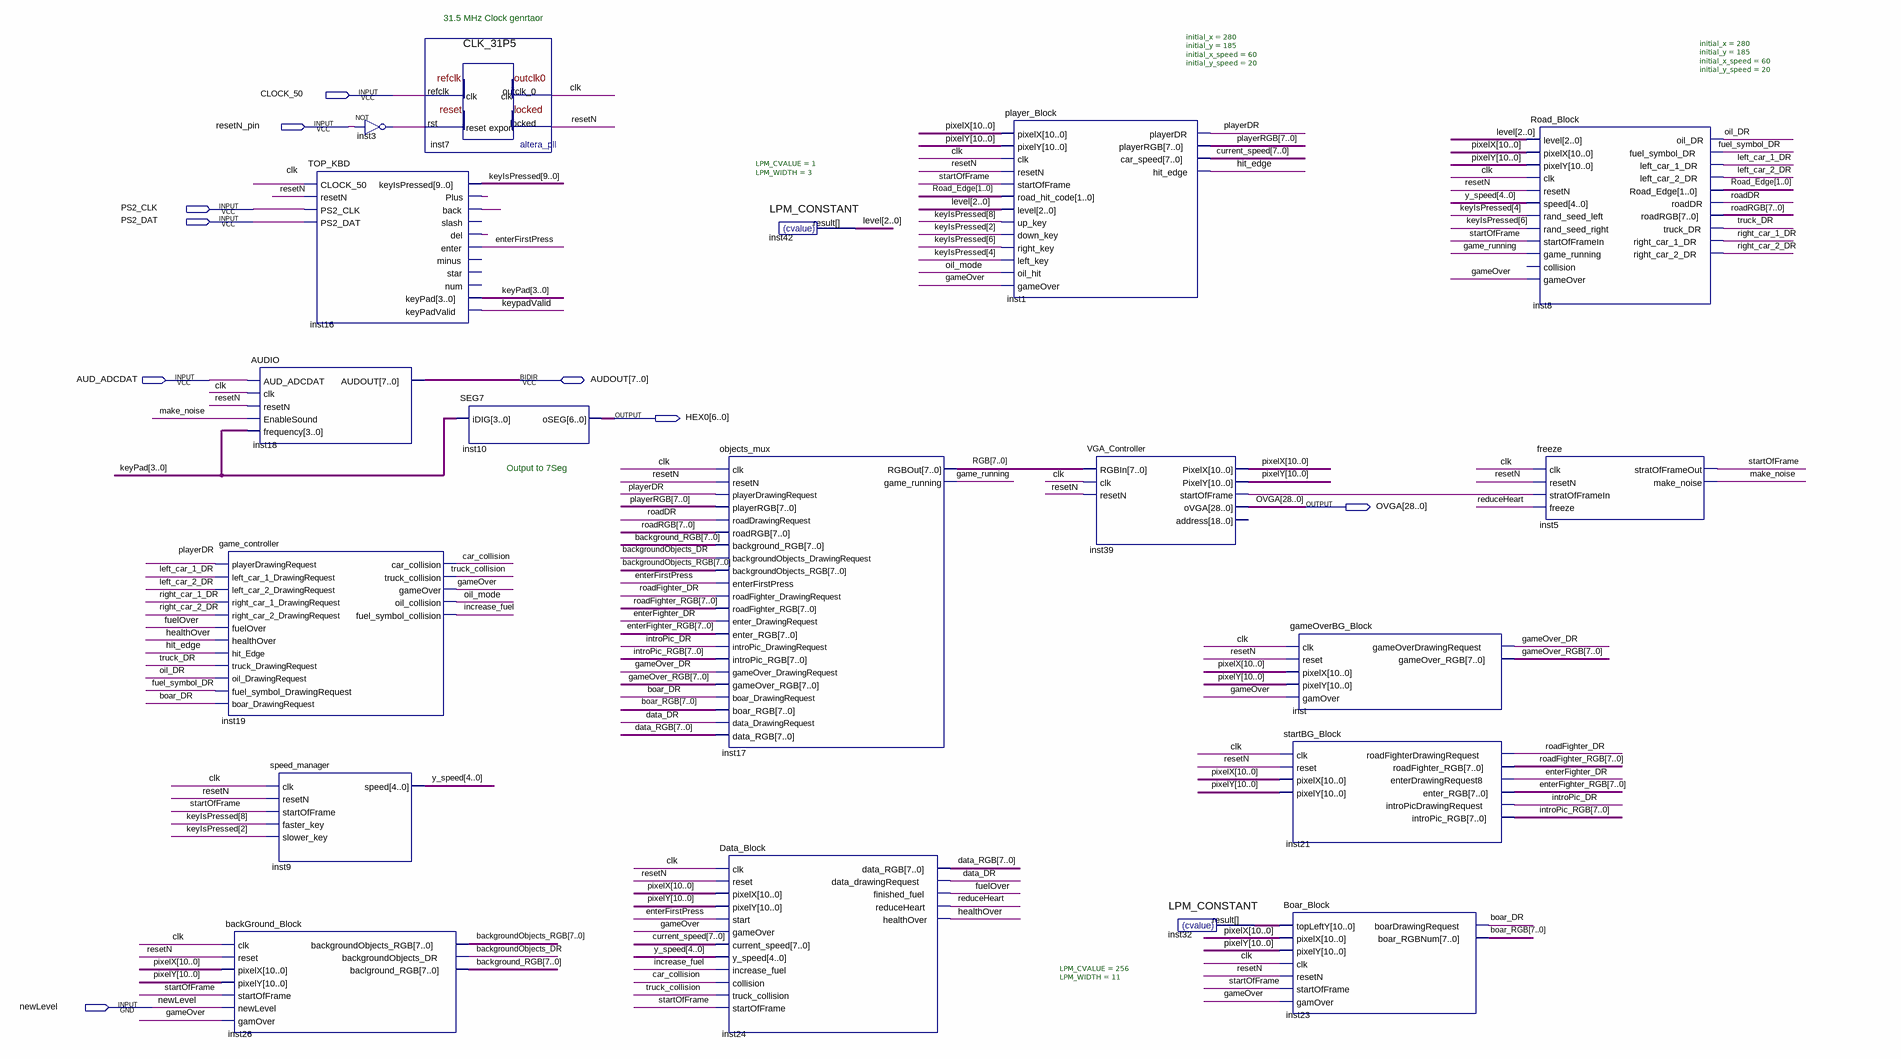
[diagram p0: schematic sheet]
// Quartus schematic TOP_VGA_DEMO_KBD.bdf as structural Verilog: 19 symbols, 9 pins
module TOP_VGA_DEMO_KBD (
  input  CLOCK_50,
  input  resetN_pin,
  input  PS2_CLK,
  input  PS2_DAT,
  input  AUD_ADCDAT,
  input  newLevel,
  inout  [7:0] AUDOUT,
  output [6:0] HEX0,
  output [28:0] OVGA
);

  wire backgroundObjects_DR, boar_DR, car_collision, clk, data_DR, enterFighter_DR, enterFirstPress,
       fuel_symbol_DR, fuelOver, game_running, gameOver, gameOver_DR, healthOver, hit_edge, increase_fuel,
       inst3_out, inst16_back, inst16_del, inst16_plus, inst39_startofframe, introPic_DR, keypadValid,
       left_car_1_DR, left_car_2_DR, make_noise, oil_DR, oil_mode, playerDR, reduceHeart, resetN,
       right_car_1_DR, right_car_2_DR, roadDR, roadFighter_DR, startOfFrame, truck_collision, truck_DR;
  wire [1:0] Road_Edge;
  wire [2:0] level;
  wire [3:0] keyPad;
  wire [4:0] y_speed;
  wire [7:0] background_RGB, backgroundObjects_RGB, boar_RGB, current_speed, data_RGB, enterFighter_RGB,
       gameOver_RGB, introPic_RGB, playerRGB, RGB, roadFighter_RGB, roadRGB;
  wire [9:0] keyIsPressed;
  wire [10:0] inst32_result, pixelX, pixelY;

  AUDIO inst18 (
    .AUD_ADCDAT(AUD_ADCDAT), .clk(clk), .resetN(resetN), .EnableSound(make_noise), .frequency(keyPad),
    .AUDOUT(AUDOUT));
  game_controller inst19 (
    .playerDrawingRequest(playerDR), .left_car_1_DrawingRequest(left_car_1_DR),
    .left_car_2_DrawingRequest(left_car_2_DR), .right_car_1_DrawingRequest(right_car_1_DR),
    .right_car_2_DrawingRequest(right_car_2_DR), .fuelOver(fuelOver), .healthOver(healthOver),
    .hit_Edge(hit_edge), .truck_DrawingRequest(truck_DR), .oil_DrawingRequest(oil_DR),
    .fuel_symbol_DrawingRequest(fuel_symbol_DR), .boar_DrawingRequest(boar_DR),
    .car_collision(car_collision), .truck_collision(truck_collision), .gameOver(gameOver),
    .oil_collision(oil_mode), .fuel_symbol_collision(increase_fuel));
  backGround_Block inst26 (
    .clk(clk), .reset(resetN), .pixelX(pixelX), .pixelY(pixelY), .startOfFrame(startOfFrame),
    .newLevel(newLevel), .gamOver(gameOver), .backgroundObjects_RGB(backgroundObjects_RGB),
    .backgroundObjects_DR(backgroundObjects_DR), .baclground_RGB(background_RGB));
  TOP_KBD inst16 (
    .CLOCK_50(clk), .resetN(resetN), .PS2_CLK(PS2_CLK), .PS2_DAT(PS2_DAT), .keyIsPressed(keyIsPressed),
    .Plus(inst16_plus), .back(inst16_back), .del(inst16_del), .enter(enterFirstPress), .keyPad(keyPad),
    .keyPadValid(keypadValid));  // open: slash, minus, star, num
  speed_manager inst9 (
    .clk(clk), .resetN(resetN), .startOfFrame(startOfFrame), .faster_key(keyIsPressed[8]),
    .slower_key(keyIsPressed[2]), .speed(y_speed));
  not inst3 (inst3_out, resetN_pin);
  CLK_31P5 inst7 (.refclk(CLOCK_50), .rst(inst3_out), .outclk_0(clk), .locked(resetN));
  SEG7 inst10 (.iDIG(keyPad), .oSEG(HEX0));
  objects_mux inst17 (
    .clk(clk), .resetN(resetN), .playerDrawingRequest(playerDR), .playerRGB(playerRGB),
    .roadDrawingRequest(roadDR), .roadRGB(roadRGB), .background_RGB(background_RGB),
    .backgroundObjects_DrawingRequest(backgroundObjects_DR), .backgroundObjects_RGB(backgroundObjects_RGB),
    .enterFirstPress(enterFirstPress), .roadFighter_DrawingRequest(roadFighter_DR),
    .roadFighter_RGB(roadFighter_RGB), .enter_DrawingRequest(enterFighter_DR), .enter_RGB(enterFighter_RGB),
    .introPic_DrawingRequest(introPic_DR), .introPic_RGB(introPic_RGB),
    .gameOver_DrawingRequest(gameOver_DR), .gameOver_RGB(gameOver_RGB), .boar_DrawingRequest(boar_DR),
    .boar_RGB(boar_RGB), .data_DrawingRequest(data_DR), .data_RGB(data_RGB), .RGBOut(RGB),
    .game_running(game_running));
  Data_Block inst24 (
    .clk(clk), .reset(resetN), .pixelX(pixelX), .pixelY(pixelY), .start(enterFirstPress),
    .gameOver(gameOver), .current_speed(current_speed), .y_speed(y_speed), .increase_fuel(increase_fuel),
    .collision(car_collision), .truck_collision(truck_collision), .startOfFrame(startOfFrame),
    .data_RGB(data_RGB), .data_drawingRequest(data_DR), .finished_fuel(fuelOver), .reduceHeart(reduceHeart),
    .healthOver(healthOver));
  LPM_CONSTANT #(.LPM_CVALUE(1), .LPM_WIDTH(3)) inst42 (.result(level));
  player_Block #(.initial_x(280), .initial_y(185), .initial_x_speed(60), .initial_y_speed(20)) inst1 (
    .pixelX(pixelX), .pixelY(pixelY), .clk(clk), .resetN(resetN), .startOfFrame(startOfFrame),
    .road_hit_code(Road_Edge), .level(level), .up_key(keyIsPressed[8]), .down_key(keyIsPressed[2]),
    .right_key(keyIsPressed[6]), .left_key(keyIsPressed[4]), .oil_hit(oil_mode), .gameOver(gameOver),
    .playerDR(playerDR), .playerRGB(playerRGB), .car_speed(current_speed), .hit_edge(hit_edge));
  VGA_Controller inst39 (
    .RGBIn(RGB), .clk(clk), .resetN(resetN), .PixelX(pixelX), .PixelY(pixelY),
    .startOfFrame(inst39_startofframe), .oVGA(OVGA));  // open: address
  LPM_CONSTANT #(.LPM_CVALUE(256), .LPM_WIDTH(11)) inst32 (.result(inst32_result));
  gameOverBG_Block inst (
    .clk(clk), .reset(resetN), .pixelX(pixelX), .pixelY(pixelY), .gamOver(gameOver),
    .gameOverDrawingRequest(gameOver_DR), .gameOver_RGB(gameOver_RGB));
  startBG_Block inst21 (
    .clk(clk), .reset(resetN), .pixelX(pixelX), .pixelY(pixelY), .roadFighterDrawingRequest(roadFighter_DR),
    .roadFighter_RGB(roadFighter_RGB), .enterDrawingRequest8(enterFighter_DR), .enter_RGB(enterFighter_RGB),
    .introPicDrawingRequest(introPic_DR), .introPic_RGB(introPic_RGB));
  Boar_Block inst23 (
    .topLeftY(inst32_result), .pixelX(pixelX), .pixelY(pixelY), .clk(clk), .resetN(resetN),
    .startOfFrame(startOfFrame), .gamOver(gameOver), .boarDrawingRequest(boar_DR), .boar_RGBNum(boar_RGB));
  Road_Block #(.initial_x(280), .initial_y(185), .initial_x_speed(60), .initial_y_speed(20)) inst8 (
    .level(level), .pixelX(pixelX), .pixelY(pixelY), .clk(clk), .resetN(resetN), .speed(y_speed),
    .rand_seed_left(keyIsPressed[4]), .rand_seed_right(keyIsPressed[6]), .startOfFrameIn(startOfFrame),
    .game_running(game_running), .gameOver(gameOver), .oil_DR(oil_DR), .fuel_symbol_DR(fuel_symbol_DR),
    .left_car_1_DR(left_car_1_DR), .left_car_2_DR(left_car_2_DR), .Road_Edge(Road_Edge), .roadDR(roadDR),
    .roadRGB(roadRGB), .truck_DR(truck_DR), .right_car_1_DR(right_car_1_DR), .right_car_2_DR(right_car_2_DR));  // open: collision
  freeze inst5 (
    .clk(clk), .resetN(resetN), .stratOfFrameIn(inst39_startofframe), .freeze(reduceHeart),
    .stratOfFrameOut(startOfFrame), .make_noise(make_noise));

  // Notes on the sheet:
  //   31.5 MHz Clock genrtaor
  //   Output to 7Seg
endmodule
